# EAGLE design LEDStick_v02 (EAGLE 5.11)
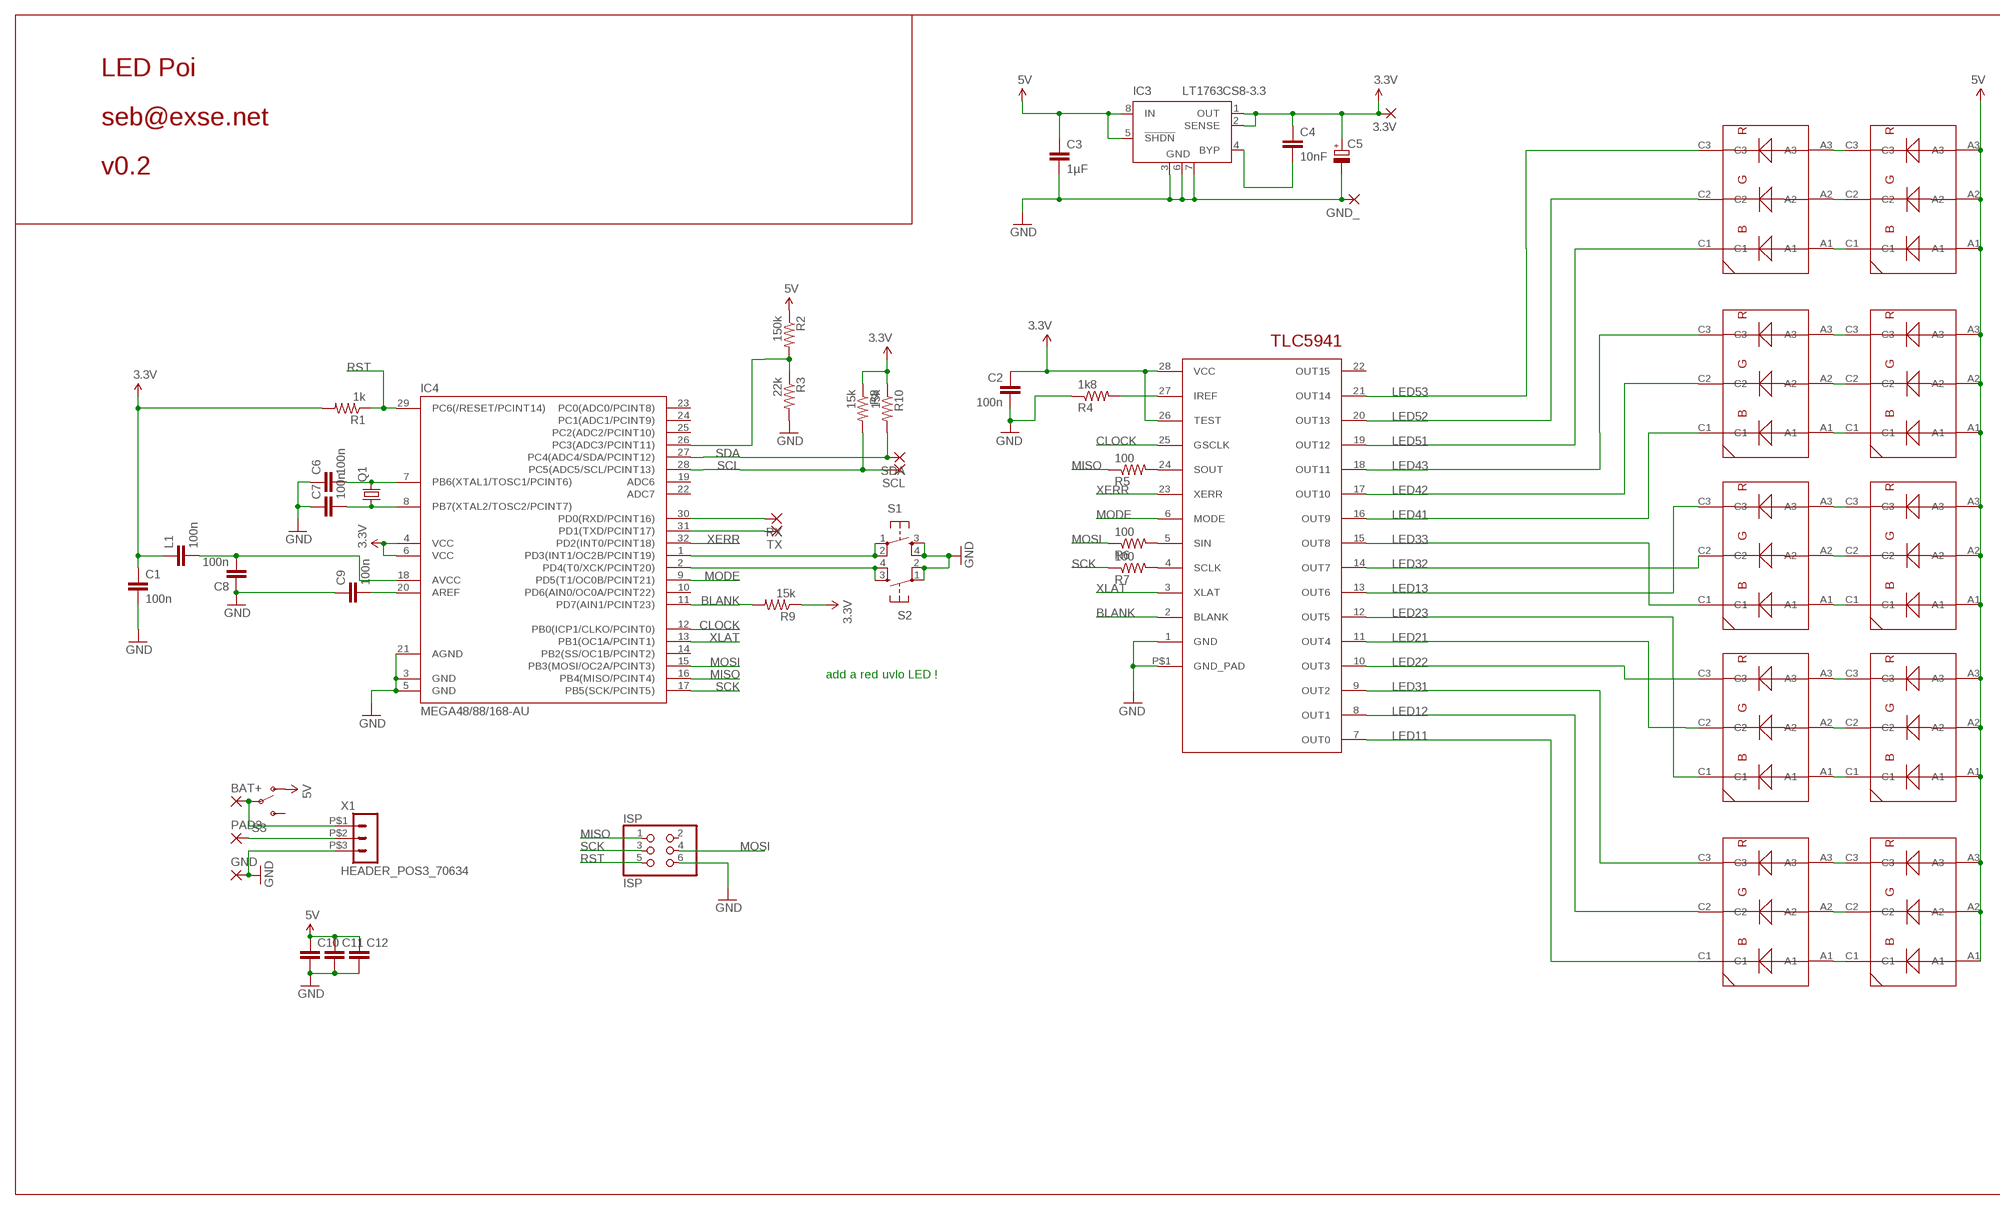
[diagram p0: schematic, sheet 1]

## Parts
3.3V  SMD2  [SMD1,27-2,54]
BAT+  SMD5  [SMD2,54-5,08]
C1  100n  CAP0805  [0805]
C2  100n  CAP0805  [0805]
C3  1µF  CAP0805  [0805]
C4  10nF  CAP0805  [0805]
C5  CPOL-EUSMCC  [SMC_C]
C6  100n  CAP0805  [0805]
C7  100n  CAP0805  [0805]
C8  100n  CAP0805  [0805]
C9  100n  CAP0805  [0805]
C10  C-EUC1210K  [C1210K]
C11  C-EUC1210K  [C1210K]
C12  C-EUC1210K  [C1210K]
D1  OSRAM_LRTB_GFTGSMALL  [PLCC-6_SMALL]
D2  OSRAM_LRTB_GFTGSMALL  [PLCC-6_SMALL]
D3  OSRAM_LRTB_GFTGSMALL  [PLCC-6_SMALL]
D4  OSRAM_LRTB_GFTGSMALL  [PLCC-6_SMALL]
D5  OSRAM_LRTB_GFTGSMALL  [PLCC-6_SMALL]
D6  OSRAM_LRTB_GFTGSMALL  [PLCC-6_SMALL]
D7  OSRAM_LRTB_GFTGSMALL  [PLCC-6_SMALL]
D8  OSRAM_LRTB_GFTGSMALL  [PLCC-6_SMALL]
D9  OSRAM_LRTB_GFTGSMALL  [PLCC-6_SMALL]
D10  OSRAM_LRTB_GFTGSMALL  [PLCC-6_SMALL]
GND  SMD5  [SMD2,54-5,08]
GND_  SMD2  [SMD1,27-2,54]
IC2  TLC5941  [SSOP28]
IC3  LT1763CS8-3.3  [SOIC8]
IC4  MEGA48/88/168-AU  [TQFP32-08]
ISP  ISP  PINHD-2X03_2.54  [2X03]
L1  100n  CAP0805  [0805]
PAD3  SMD5  [SMD2,54-5,08]
Q1  X22-OSCILLATOR  [X22]
R1  1k  RESISTOR  [0805]
R2  150k  RESISTOR  [0805]
R3  22k  RESISTOR  [0805]
R4  1k8  RESISTOR  [0805]
R5  100  RESISTOR  [0805]
R6  100  RESISTOR  [0805]
R7  100  RESISTOR  [0805]
R8  15k  RESISTOR  [0805]
R9  15k  RESISTOR  [0805]
R10  15k  RESISTOR  [0805]
RX  SMD2  [SMD1,27-2,54]
S1  LSH  [LSH]
S2  LSH  [LSH]
S3  SWITCH-SPSTPTH_LOCK  [SWITCH-SPDT_LOCK.007S]
SCL  SMD2  [SMD1,27-2,54]
SDA  SMD2  [SMD1,27-2,54]
TX  SMD2  [SMD1,27-2,54]
X1  HEADER_POS3_70634  [70634-POS3]

## Nets
3.3V: 3.3V.1(P) C1.1 C2.1 C4.1 C5.+ IC2.26(TEST) IC2.28(VCC) IC3.1(OUT) IC3.2(SENSE) IC4.4(VCC) IC4.6(VCC) L1.1 R1.2 R8.1 R9.1 R10.1
5V: C3.1 C10.1 C11.1 C12.1 D1.A1 D1.A2 D1.A3 D3.A1 D3.A2 D3.A3 D5.A1 D5.A2 D5.A3 D7.A1 D7.A2 D7.A3 D9.A1 D9.A2 D9.A3 IC3.5(!SHDN) IC3.8(IN) R2.1 S3.1(O)
BLANK: IC2.2(BLANK) IC4.11(PD7(AIN1/PCINT23)) R9.2
CLOCK: IC2.25(GSCLK) IC4.12(PB0(ICP1/CLKO/PCINT0))
GND: C1.2 C2.2 C3.2 C5.- C6.1 C7.1 C8.1 C9.1 C10.2 C11.2 C12.2 GND.1(P) GND_.1(P) IC2.1(GND) IC2.P$1(GND_PAD) IC3.3(GND) IC3.6(GND) IC3.7(GND) IC4.3(GND) IC4.5(GND) IC4.21(AGND) ISP.6 R3.2 R4.1 S1.3 S1.4 S2.1 S2.2 X1.P$3
LED11: D10.C1 IC2.7(OUT0)
LED12: D10.C2 IC2.8(OUT1)
LED13: D6.C3 IC2.13(OUT6)
LED21: D8.C2 IC2.11(OUT4)
LED22: D8.C3 IC2.10(OUT3)
LED23: D8.C1 IC2.12(OUT5)
LED31: D10.C3 IC2.9(OUT2)
LED32: D6.C2 IC2.14(OUT7)
LED33: D6.C1 IC2.15(OUT8)
LED41: D4.C1 IC2.16(OUT9)
LED42: D4.C2 IC2.17(OUT10)
LED43: D4.C3 IC2.18(OUT11)
LED51: D2.C1 IC2.19(OUT12)
LED52: D2.C2 IC2.20(OUT13)
LED53: D2.C3 IC2.21(OUT14)
MISO: IC4.16(PB4(MISO/PCINT4)) ISP.1 R5.1
MODE: IC2.6(MODE) IC4.9(PD5(T1/OC0B/PCINT21))
MOSI: IC4.15(PB3(MOSI/OC2A/PCINT3)) ISP.4 R6.1
N$1: IC2.24(SOUT) R5.2
N$2: C4.2 IC3.4(BYP)
N$3: C6.2 IC4.7(PB6(XTAL1/TOSC1/PCINT6)) Q1.3
N$4: IC2.5(SIN) R6.2
N$5: IC2.4(SCLK) R7.2
N$6: C7.2 IC4.8(PB7(XTAL2/TOSC2/PCINT7)) Q1.1
N$7: D1.C3 D2.A3
N$8: D1.C2 D2.A2
N$9: D1.C1 D2.A1
N$10: D3.C3 D4.A3
N$11: D3.C2 D4.A2
N$12: D3.C1 D4.A1
N$13: IC2.27(IREF) R4.2
N$14: D5.C3 D6.A3
N$15: D5.C2 D6.A2
N$16: D5.C1 D6.A1
N$17: D7.C3 D8.A3
N$18: D7.C2 D8.A2
N$19: D7.C1 D8.A1
N$20: D9.C3 D10.A3
N$21: D9.C2 D10.A2
N$22: D9.C1 D10.A1
N$23: IC4.1(PD3(INT1/OC2B/PCINT19)) S1.1 S1.2
N$24: IC4.2(PD4(T0/XCK/PCINT20)) S2.3 S2.4
N$25: IC4.26(PC3(ADC3/PCINT11)) R2.2 R3.1
N$26: BAT+.1(P) S3.2(P) X1.P$1
N$27: C8.2 IC4.18(AVCC) L1.2
N$28: C9.2 IC4.20(AREF)
N$29: PAD3.1(P) X1.P$2
N$31: IC4.30(PD0(RXD/PCINT16)) RX.1(P)
N$32: IC4.31(PD1(TXD/PCINT17)) TX.1(P)
RST: IC4.29(PC6(/RESET/PCINT14)) ISP.5 R1.1
SCK: IC4.17(PB5(SCK/PCINT5)) ISP.3 R7.1
SCL: IC4.28(PC5(ADC5/SCL/PCINT13)) R8.2 SCL.1(P)
SDA: IC4.27(PC4(ADC4/SDA/PCINT12)) R10.2 SDA.1(P)
XERR: IC2.23(XERR) IC4.32(PD2(INT0/PCINT18))
XLAT: IC2.3(XLAT) IC4.13(PB1(OC1A/PCINT1))
Unconnected: IC2.22(OUT15) IC4.10(PD6(AIN0/OC0A/PCINT22)) IC4.14(PB2(SS/OC1B/PCINT2)) IC4.19(ADC6) IC4.22(ADC7) IC4.23(PC0(ADC0/PCINT8)) IC4.24(PC1(ADC1/PCINT9)) IC4.25(PC2(ADC2/PCINT10)) ISP.2 S3.3(S)

## Notes on the sheet
- LED Poi
- seb@exse.net
- v0.2
- add a red uvlo LED !

## Library data of the parts
3.3V GND_ RX SCL SDA TX = wirepad:SMD2: SMD PAD
BAT+ GND PAD3 = wirepad:SMD5: SMD PAD
C1-C4 C6-C9 L1 = SparkFun:CAP: Capacitor Standard 0603 ceramic capacitor, and 0.1" leaded capacitor.
C5 = resistor:CPOL-EU: POLARIZED CAPACITOR, European symbol
C10-C12 = rcl:C-EU: CAPACITOR, European symbol
D1-D10 = seb:OSRAM_LRTB_GFTG
IC2 = tlc:TLC5941
IC3 = linear-technology:LT1763CS8: 500mA, Low Noise, LDO Micropower Regulators Source: http://cds.linear.com/docs/Datasheet/1763ff.pdf
IC4 = avr-7:MEGA48/88/168
ISP = pinhead-2:PINHD-2X03: PIN HEADER
Q1 = seb:X22-OSCILLATOR
R1-R10 = SparkFun:RESISTOR: Resistor Basic schematic elements and footprints for 0603, 1206, and PTH 1/10th watt (small) resistors.
S1 S2 = switch-tact:LSH
S3 = SparkFun:SWITCH-SPST: SPST Switch Simple slide switch. Spark Fun Electronics SKU : COM-00102
X1 = con-molex-c-grid-sl:HEADER_POS3_?: Molex -C-Grid® / SL Series connector Wire-to-Board 2.54 mm (0.100") pitch header, 3 positions.

## Board
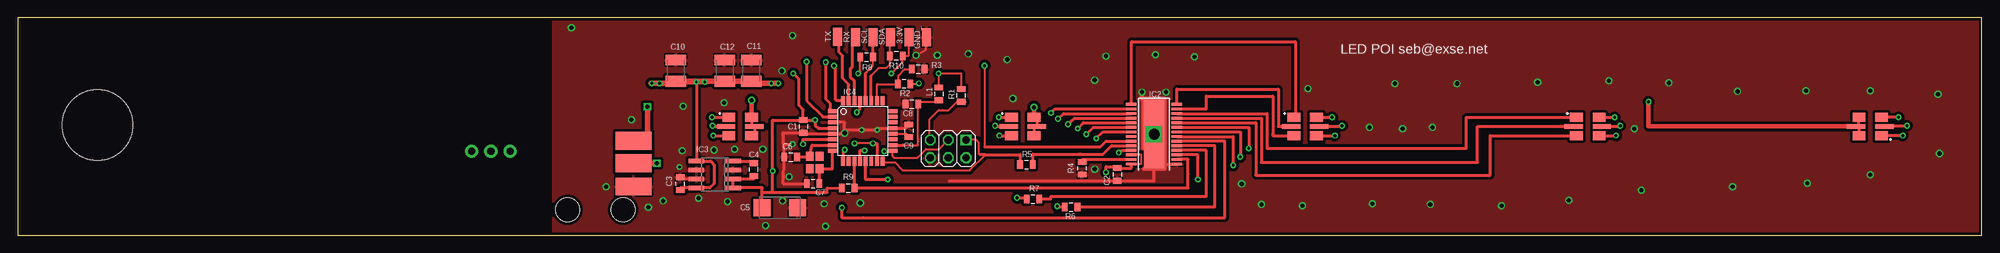
[diagram p1: board, top side]
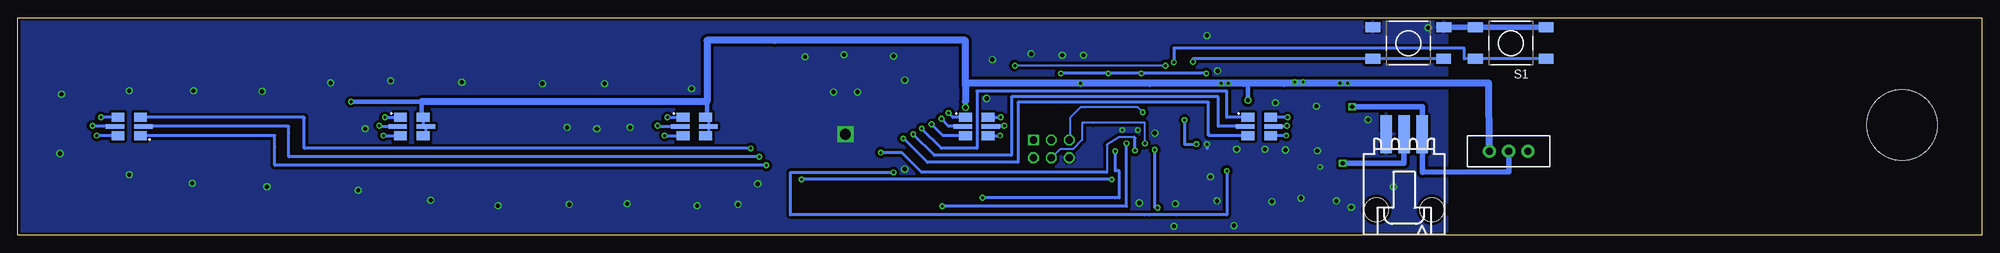
[diagram p2: board, bottom side, seen from below]

Size 278.1 x 30.8 mm. Coordinates in mm from the lower left corner, seen from the top.
Outline: 278.1,30.8 0,30.8 0,0 278.1,0 278.1,30.8
Copper layers (1*16): Top 0.035mm / dielectric 1.5mm / Bottom 0.035mm
Design rules "default *": minimum track width 10mil, minimum drill 0.4mm, track to track 8mil, track to pad 8mil, pad to pad 8mil, via to via 8mil, smd to smd 8mil, copper to edge 8mil, drill to drill 8mil, minimum pad ring 10mil, minimum via ring 8mil, stop-mask expansion 4mil, vias tented up to drill 100mil, thermal gap 10mil
Holes 10 mm at 11.3,15.6

### Footprints (pad centres in the part's own frame; a part is rotated, then mirrored left to right if it is on the bottom)
SMD1,27-2,54 = smd 1.27 x 2.54: 1 0,0
SMD2,54-5,08 = smd 2.54 x 5.08: 1 0,0
0805 = smd 0.8 x 1.2: 1 -0.9,0; 2 0.9,0
SMC_C = smd 2.4 x 2.4: + -2.5,0; - 2.5,0
C1210K = smd 1.5 x 2.9: 1 -1.5,0; 2 1.5,0
PLCC-6_SMALL = smd 1.3 x 1.8: A1 1.3,-1.6; A3 -1.3,-1.6; C1 1.3,1.6; C3 -1.3,1.6 | smd 0.6 x 2.6: A2 0,-2; C2 0,2
SSOP28 = smd 0.4 x 1.5: 1 -4.225,-3.225; 2 -3.575,-3.225; 3 -2.925,-3.225; 4 -2.275,-3.225; 5 -1.625,-3.225; 6 -0.975,-3.225; 7 -0.325,-3.225; 8 0.325,-3.225; 9 0.975,-3.225; 10 1.625,-3.225; 11 2.275,-3.225; 12 2.925,-3.225; 13 3.575,-3.225; 14 4.225,-3.225; 15 4.225,3.225; 16 3.575,3.225; 17 2.925,3.225; 18 2.275,3.225; 19 1.625,3.225; 20 0.975,3.225; 21 0.325,3.225; 22 -0.325,3.225; 23 -0.975,3.225; 24 -1.625,3.225; 25 -2.275,3.225; 26 -2.925,3.225; 27 -3.575,3.225; 28 -4.225,3.225 | smd 9.7 x 2.8: P$1 0,0
SOIC8 = smd 0.6 x 2.2: 1 -1.905,-2.6; 2 -0.635,-2.6; 3 0.635,-2.6; 4 1.905,-2.6; 5 1.905,2.6; 6 0.635,2.6; 7 -0.635,2.6; 8 -1.905,2.6
TQFP32-08 = smd 1.27 x 0.559: 1 -4.293,2.8; 2 -4.293,2; 3 -4.293,1.2; 4 -4.293,0.4; 5 -4.293,-0.4; 6 -4.293,-1.2; 7 -4.293,-2; 8 -4.293,-2.8; 17 4.293,-2.8; 18 4.293,-2; 19 4.293,-1.2; 20 4.293,-0.4; 21 4.293,0.4; 22 4.293,1.2; 23 4.293,2; 24 4.293,2.8 | smd 0.559 x 1.27: 9 -2.8,-4.293; 10 -2,-4.293; 11 -1.2,-4.293; 12 -0.4,-4.293; 13 0.4,-4.293; 14 1.2,-4.293; 15 2,-4.293; 16 2.8,-4.293; 25 2.8,4.293; 26 2,4.293; 27 1.2,4.293; 28 0.4,4.293; 29 -0.4,4.293; 30 -1.2,4.293; 31 -2,4.293; 32 -2.8,4.293
2X03 = drill 1.016 square: 1 -2.54,-1.27 | drill 1.016 octagon: 2 -2.54,1.27; 3 0,-1.27; 4 0,1.27; 5 2.54,-1.27; 6 2.54,1.27
X22 = smd 1.3 x 1.1: 1 0.9,0.7; 2 -0.9,0.7; 3 -0.9,-0.7; 4 0.9,-0.7
LSH = smd 2.1 x 1.4: 1 -5.005,2.24; 2 5.015,2.24; 3 -5.005,-2.24; 4 5.005,-2.24
SWITCH-SPDT_LOCK.007S = drill 1.016 pad 1.88 round: 1 0,2.718; 2 0,0; 3 0,-2.718
70634-POS3 = smd 1.651 x 5.334: P$1 -2.54,0; P$2 0,0; P$3 2.54,0 | hole 3.404: -3.937,10.693; 3.937,10.693

### Placement (x,y rotation side)
3.3V  126.2,28 0 top
BAT+  87.2,13.4 90 top
C1  111.23,15.41 270 top
C2  155.71,8.61 270 top
C3  93.8,7.3 90 top
C4  104.2,9.3 90 top
C5  107.9,3.9 0 top
C6  109.45,11.11 0 top
C7  112.61,7.3 0 top
C8  126.6,18.6 0 top
C9  126.2,14.8 270 top
C10  93.2,23.3 90 top
C11  103.9,23.3 90 top
C12  100.1,23.3 90 top
D1  102.3,15.4 90 top
D2  102.3,15.4 90 bottom
D3  142.3,15.4 90 top
D4  142.3,15.4 90 bottom
D5  182.3,15.4 90 bottom
D6  182.3,15.4 90 top
D7  222.3,15.4 90 bottom
D8  222.3,15.4 90 top
D9  262.3,15.4 270 top
D10  262.3,15.4 270 bottom
GND  87.2,6.9 90 top
GND_  128.7,28 0 top
IC2  160.9,14.3 90 top
IC3  98.7,8.6 90 top
IC4  119.66,14.77 0 top
ISP  131.75,12.22 180 top
L1  130.4,20 270 top
PAD3  87.2,10.2 90 top
Q1  112.85,10.3 270 top
R1  133.59,19.79 90 top
R2  125.5,21.4 180 top
R3  127.5,23.5 0 top
R4  150.7,9.49 90 top
R5  142.82,10 0 top
R6  149.15,4.03 0 top
R7  143.75,5.15 0 top
R8  120.2,25.2 0 top
R9  117.6,6.7 0 top
R10  124.4,25.4 180 top
RX  118.6,28 0 top
S1  66.7,27.2 180 bottom
S2  81.2,27.2 0 bottom
S3  67,11.9 90 bottom
SCL  121.1,28 0 top
SDA  123.6,28 0 top
TX  116.1,28.1 0 top
X1  81.8,14.3 180 bottom

### Tracks (layer width: path | path; a pad name or v marks a point on that pad's centre or on a via)
3.3V  (via drill 0.4)
  Top 0.305: IC2.26 159.1,11.38 159.1,10.1 157.68,10.1 IC2.28 | R1.2 133.59,22.9 v130.4,22.9 | 130.59,22.9 130.5,22.9 130.59,22.9 | v130.4,22.9 130.59,22.9 | v130.4,22.9 L1.1 | v130.4,22.9 130.59,22.9 | v123.7,22.9 125,24.2 125.3,24.5 R10.1 126.1,25.4 126.2,25.5 3.3V.1 | v119,22.9 119.3,23.2 R8.1
  Top 0.406: IC2.28 157.68,9.51 C2.1 155.71,9.7 154.1,9.7 v154.1,8.9 | C1.1 106.9,16.31 106.9,6.1 | 106.9,6.1 v106.9,9.1 | 106.9,6.1 v106.9,9.1 | v130.4,22.9 130.59,22.9 | 130.59,22.9 130.5,22.9 130.59,22.9 | 109.83,22.9 v109.8,22.9 110.6,22.1 110.6,18.4 111.23,17.77 C1.1 | R9.1 114.63,6.68 114.63,6.08 106.9,6.1 | 106.9,6.1 v106.9,9.1 | C4.1 104.2,7.96 IC3.2 IC3.1 105.4,6.7 105.4,6.1 | 105.4,6.1 C5.+ 105.4,6.1 | 105.4,6.1 106.9,6.1 | C1.1 111.8,16.31 | 111.8,16.31 v112.9,16.31 | v112.9,16.31 112.9,15.5 113.3,15.17 113.44,15.17 IC4.4 | v111.2,12.9 111.2,13.49 | 111.2,13.49 111.2,13.57 | 111.8,16.31 v112.9,16.31 | IC4.6 113.44,13.57 111.2,13.57 | 111.2,13.49 111.2,13.57
  Bottom 0.305: 118.6,22.9 v119,22.9 | v123.7,22.9 123.5,22.9
  Bottom 0.406: v154.1,8.9 168.7,8.9 168.7,6.5 168.7,2.9 117.9,2.9 | 117.9,2.9 114.1,2.9 106.9,2.9 v106.9,9.1 | 117.9,2.9 118.5,2.9 | v109.8,22.9 118.6,22.9 | 118.6,22.9 v119,22.9 | 118.6,22.9 v119,22.9 | 118.6,22.9 v119,22.9 | v119,22.9 v123.7,22.9 123.5,22.9 v130.4,22.9 | v111.2,12.9 112.9,12.9 v112.9,16.31
5V  (via drill 0.4, 0.6)  (1 unrouted)
  Top 0.305: R2.1 127.6,21.4 v127.6,21.5
  Top 0.406: 260.7,15.4 D9.A1 | 260.7,15.4 D9.A2 260.7,15.4 | 260.7,15.4 D9.A3 | D1.A3 104.3,14.1 D1.A2 | D1.A2 103.9,15.4 D1.A1 | D1.A2 104.5,15.4 | D3.A3 143.9,15.4 D3.A2 144.3,16.7 D3.A1 | C3.1 93.8,6.7 IC3.8 98,6.7 98.6,7.3 98.6,10 98.3,10.3 98.09,10.51 IC3.5 v96.1,21.7
  Top 0.61: D9.A2 230.9,15.4 v230.9,18.9 | v103.9,19.1 103.9,17.9 D1.A1 | v143.9,18.1 D3.A1 | v96.1,21.7 96.1,21.6
  Top 0.813: v106.7,21.5 103.9,21.5 C11.1 C12.1 C10.1 93.2,21.5 93.5,21.5 93.5,21.7 v96.1,21.7 v97.3,21.7 | v106.7,21.5 v107.7,21.5 v106.7,21.5 | v89.8,21.5 89.7,21.5 89.7,21.51 | v89.8,21.5 v90.9,21.5 | v90.9,21.5 93.5,21.5 | v89.8,21.5 v90.9,21.5
  Bottom 0.406: D5.A1 180.3,16.7 D5.A2 180.3,14.1 D5.A3 | D7.A3 220.3,14.1 D7.A2 220.7,15.4 D7.A1 | v96.1,21.7 100.5,21.7 98.8,21.5
  Bottom 0.61: v230.9,18.9 220.9,18.9 220.9,16.7 D7.A1 | 117.8,21.5 v127.6,21.5 | 180.3,16.7 180.5,16.7 180.5,18.9 | 143.9,18.9 v143.9,18.1 | 104.5,21.5 103.9,21.5 v103.9,19.1
  Bottom 1.016: 220.9,18.9 180.5,18.9 180.5,27.6 170.9,27.6 143.9,27.6 143.9,21.2 | 143.9,21.2 143.9,21.5 v127.6,21.5 117.8,21.5 104.5,21.5 98.8,21.5 69.8,21.52 S3.1 | 143.9,21.2 143.9,18.9
BLANK
  Top 0.406: IC2.2 165.7,10.72 165.7,8.7 165.7,6.7 137.5,6.7 R9.2 | R9.2 118.46,6.7 R9.2 | IC4.11 118.5,10.48 R9.2
CLOCK  (via drill 0.4)
  Top 0.406: IC2.25 156.3,12.03 v155.9,11.7 | v119.9,12 119.26,12 IC4.12
  Bottom 0.305: 123.9,8.9 123.9,12.8 122.2,13.9 120,13.9 119.9,13.8
  Bottom 0.406: v155.9,11.7 152.9,11.7 150.1,8.9 123.9,8.9 | v119.9,12 119.9,13.8 120,13.9
GND  (via drill 0.4, 0.6, 1.5)
  Top 0.305: 125.8,15.17 C9.1 | v127.2,25.46 128.6,26.27 GND_.1
  Top 0.406: IC2.1 160.9,10.07 IC2.P$1 160.9,7.71 C2.2 131.89,7.71 | C7.1 108.4,7.3 C6.1 108.4,14.51 | 108.4,14.51 C1.2 111.63,14.37 IC4.5 117.1,14.37 v117.1,14.46 | IC3.7 94.2,7.96 C3.2 | 108.4,14.51 108.4,12.9 v109.7,12.9 | IC4.3 117.1,15.97 v117.1,14.46 | v117.1,14.46 117.1,14.9 v119.5,14.9 v121.7,14.9 121.7,15.17 IC4.21 125.8,15.17
  Top 0.61: 159.5,9.4 162.4,9.4 162.4,19.3 159.4,19.3 | 159.4,19.3 159.4,12.3 | v159.2,20.27 159.2,19.3 159.4,19.3
  Bottom 0.406: v109.7,12.9 109.7,12.27
  Bottom 0.813: S2.2 S1.4 S1.3
  other vias: 93.7,9.66 101.5,12.16 105.9,1.36 100.5,4.76 109.2,8.27 100,18.77 114.2,4.46 166.6,25.27 161.1,25.57 154.1,25.36 140.9,19.36 162.6,20.27 152.5,9.37 182.7,20.77 195,21.46 203.8,21.46 215.2,21.66 225.3,21.86 233.8,21.57 243.5,20.36 253.2,20.46 262.3,20.46 271.9,19.96 272.1,11.56 262.3,8.56 253.4,7.37 242.8,6.87 229.9,6.37 219.6,4.96 210.1,4.17 200,4.37 191.8,4.46 181.9,4.17 176.1,4.37 191.4,15.27 196.1,15.06 200.3,15.27 228.9,15.06 134.6,25.66 130.2,25.46 109.7,28.27 108.2,23.27 105.5,12.16 108.3,4.87 119.3,4.57 114.4,1.26 173.3,7.26 152.5,21.96 140.1,24.86 83.3,6.87 94.2,18.27 89.3,3.96 91.4,4.87 98.6,12.06 96.4,5.26 94.1,11.96 160.9,14.3 78.4,29.36 86.9,16.36
  pour Bottom (isolate 0.406): 75.8,0.1 278.1,0 278.2,30.8 75.8,30.9
  pour Top (isolate 0.406): 75.8,0.1 278.2,0 278.2,30.8 75.8,30.9
LED11  (via drill 0.4)
  Top 0.406: IC2.7 172.1,13.97 v172.1,9.9
  Bottom 0.406: v172.1,9.9 241.7,9.9 241.7,12.5 241.7,14.1 D10.C1
LED12  (via drill 0.4)
  Top 0.406: IC2.8 173.1,14.62 v173.1,11.1
  Bottom 0.406: v173.1,11.1 239.7,11.1 239.7,14.5 239.7,15.4 D10.C2
LED13
  Top 0.406: IC2.13 168.3,17.88 168.3,19.7 177.7,19.7 177.7,14.3 177.7,14.1 D6.C3
LED21
  Top 0.406: IC2.11 176.1,16.57 176.1,10.3 204.9,10.3 206.7,10.3 206.7,15.4 D8.C2
LED22
  Top 0.406: IC2.10 175.3,15.93 175.3,8.5 208.5,8.5 208.5,14.1 D8.C3
LED23
  Top 0.406: IC2.12 176.9,17.23 176.9,12.3 205.1,12.3 205.1,12.5 205.1,16.7 D8.C1
LED31  (via drill 0.4)
  Top 0.406: IC2.9 174.3,15.28 v174.3,12.3
  Bottom 0.406: v174.3,12.3 237.5,12.3 237.5,16.5 237.5,16.7 D10.C3
LED32
  Top 0.406: IC2.14 164.12,20.7 178.5,20.7 178.5,15.4 D6.C2
LED33
  Top 0.406: IC2.15 157.7,18.52 157.7,27.4 180.9,27.4 180.9,16.7 D6.C1
LED41  (via drill 0.4)
  Top 0.406: v146.3,17.3 146.9,17.88 IC2.16
  Bottom 0.406: D4.C1 145.7,16.7 v146.3,17.3
LED42  (via drill 0.4)
  Top 0.406: v147.3,16.5 148.1,17.23 IC2.17
  Bottom 0.406: D4.C2 146.3,15.4 v147.3,16.5
LED43  (via drill 0.4)
  Top 0.406: v148.7,15.7 149.7,16.57 IC2.18
  Bottom 0.406: D4.C3 147.1,14.1 v148.7,15.7
LED51  (via drill 0.4)
  Top 0.406: IC2.19 150.9,15.93 v150.1,15.1
  Bottom 0.406: v150.1,15.1 147.3,12.3 142.3,12.3 142.3,20.4 106.9,20.4 106.9,16.9 106.9,16.7 D2.C1
LED52  (via drill 0.4)
  Top 0.406: IC2.20 152.3,15.28 v151.3,14.3
  Bottom 0.406: v151.3,14.3 148.3,11.3 137.4,11.3 137.4,19.6 108.1,19.6 108.1,16.1 108.1,15.4 D2.C2
LED53  (via drill 0.4)
  Top 0.406: IC2.21 153.7,14.62 v152.7,13.7
  Bottom 0.406: v152.7,13.7 149.3,10.3 136.5,10.3 136.5,18.8 109.5,18.8 109.5,14.5 109.5,14.1 D2.C3
MISO
  Top 0.305: ISP.1 135.7,13.49 136.1,13.1 136.1,11.5 136.2,11.4 | 122.46,10.3 124.2,10.3 125.3,9.2 134.8,9.2 137,11.4
  Top 0.406: 136.2,11.4 137,11.4 141.93,11.4 R5.1 | IC4.16 122.46,10.3
MODE  (via drill 0.4)
  Top 0.406: IC2.6 170.9,13.32 170.9,4.5 170.9,2.5 119.7,2.5 116.86,2.5 116.7,2.5 v116.7,3.9 | 116.86,12.1 v117.1,12.1 116.86,12.1 | 116.86,12.1 IC4.9
  Bottom 0.406: v116.7,3.9 117.1,3.9 v117.1,12.1
MOSI  (via drill 0.4)
  Top 0.305: v121.1,13 v118.5,13
  Top 0.406: R6.1 147.3,4.03 v147.2,4.1 | v121.1,13 121.66,13 IC4.15
  Bottom 0.305: v118.5,13 118.5,15.9 119.1,15.9 125.8,15.9 127.1,15.9 127.4,15.9 127.4,13.5 128.7,12.2 130.5,12.2 ISP.4
  Bottom 0.406: v147.2,4.1 121.1,4.1 v121.1,13
N$1
  Top 0.406: IC2.24 154.9,12.68 153.7,11.5 150.5,11.5 150.3,11.5 143.72,11.5 R5.2
N$2
  Top 0.406: IC3.4 104.2,10.51 C4.2
N$3
  Top 0.406: C6.2 111.8,11.1 Q1.3 112.5,12.77 IC4.7
N$4
  Top 0.406: IC2.5 169.5,12.68 169.5,5.7 169.5,4.03 R6.2
N$5
  Top 0.406: IC2.4 168.3,12.03 168.3,6.9 168.3,5.5 146.3,5.5 146.3,5.15 R7.2
N$6
  Top 0.406: 115.01,9.4 Q1.1 C7.2 | 115.01,9.4 115.37,9.4 | 115.37,9.4 IC4.8 | 115.01,9.4 115.37,9.4
N$7  (via drill 0.4)
  Top 0.406: v98.5,14.1 D2.A3
  Bottom 0.406: v98.5,14.1 D2.A3
N$8  (via drill 0.4)
  Top 0.406: D2.A2 98.5,15.4 v98.4,15.5
  Bottom 0.406: v98.4,15.5 98.4,15.4 D2.A2
N$9  (via drill 0.4)
  Top 0.406: v98.3,16.7 D2.A1
  Bottom 0.406: v98.3,16.7 D2.A1
N$10  (via drill 0.4)
  Top 0.406: v139,14.1 D4.A3
  Bottom 0.406: D4.A3 v139,14.1
N$11  (via drill 0.4)
  Top 0.406: v138.4,15.5 138.6,15.4 D4.A2
  Bottom 0.406: D4.A2 138.4,15.4 v138.4,15.5
N$12  (via drill 0.4)
  Top 0.406: v138.9,16.7 D4.A1
  Bottom 0.406: D4.A1 v138.9,16.7
N$13
  Top 0.406: IC2.27 150.7,10.72 R4.2
N$14  (via drill 0.4)
  Top 0.406: D6.A3 v186.5,14.1
  Bottom 0.406: v186.5,14.1 D6.A3
N$15  (via drill 0.4)
  Top 0.406: D6.A2 187.5,15.4 v187.5,15.5
  Bottom 0.406: v187.5,15.5 187.5,15.4 D6.A2
N$16  (via drill 0.4)
  Top 0.406: D6.A1 v186.1,16.7
  Bottom 0.406: v186.1,16.7 D6.A1
N$17  (via drill 0.4)
  Top 0.406: D8.A3 v226.3,14.1
  Bottom 0.406: v226.3,14.1 D8.A3
N$18  (via drill 0.4)
  Top 0.406: v226.9,15.5 226.8,15.4 D8.A2
  Bottom 0.406: D8.A2 226.9,15.4 v226.9,15.5
N$19  (via drill 0.4)
  Top 0.406: D8.A1 v226.1,16.7
  Bottom 0.406: v226.1,16.7 D8.A1
N$20  (via drill 0.4)
  Top 0.406: v266.3,16.7 D10.A3
  Bottom 0.406: D10.A3 v266.3,16.7
N$21  (via drill 0.4)
  Top 0.406: D10.A2 267.5,15.4 v267.5,15.5
  Bottom 0.406: v267.5,15.5 267.5,15.4 D10.A2
N$22  (via drill 0.4)
  Top 0.406: v266.9,14.1 D10.A1
  Bottom 0.406: D10.A1 v266.9,14.1
N$23  (via drill 0.4)
  Top 0.406: v114.4,24.5 114.4,19.3 115,18.7 115,17.94 115,17.57 IC4.1
  Bottom 0.406: S1.1 S1.2 73.3,24.96 73.3,26.5 114.4,26.5 v114.4,24.5 114.34,24.56
N$24  (via drill 0.4)
  Top 0.406: 111.7,23.6 111.7,19.07 114,16.77 IC4.2 | 111.7,23.6 v111.7,24.56 111.7,23.6
  Bottom 0.406: S2.4 S2.3 111.7,24.96 v111.7,24.56
N$25
  Top 0.305: 121.7,19.06 121.7,19.1 121.7,21.4 R2.2 124.7,21.4 124.7,22.6 125.6,23.5 R3.1
  Top 0.406: IC4.26 121.7,19.1
N$26  (via drill 0.6)
  Top 0.813: BAT+.1 89.16,13.4 v89.16,18.2
  Bottom 0.813: X1.P$1 79.56,14.3 79.2,14.3 | 79.2,18.2 v89.16,18.2 | 79.2,14.3 79.2,18.2 | S3.2 67,9 79.2,8.9 79.2,13.4 79.2,14.3 | 79.2,14.3 79.2,18.2
  Bottom 1.016: 79.56,14.3 X1.P$1
N$27
  Top 0.305: 125.33,12.77 127.47,12.77 127.5,13.3 127.5,13.6 C8.2 127.5,18.9 130.4,18.9 L1.2
  Top 0.406: IC4.18 125.33,12.77
N$28
  Top 0.305: 123.98,14.4 125.8,14.4 C9.2
  Top 0.406: 123.98,14.4 IC4.20
N$29  (via drill 0.6)
  Top 0.813: v90.5,10.2 PAD3.1
  Bottom 0.813: v90.5,10.2 81.8,10.2 X1.P$2
N$31
  Top 0.406: RX.1 118.2,27.6 118.2,25.9 118.2,23.9 117.9,23.6 117.9,22.4 118.46,21.84 IC4.30
N$32
  Top 0.406: TX.1 116.3,27.9 116.3,25.9 116.8,25.4 116.8,22.2 117.66,21.34 IC4.31
RST  (via drill 0.4)
  Top 0.305: v118.8,17.4 119.26,17.86 | 134.21,18.89 R1.1 132.99,18.89 131.8,17.7 131.01,17.7 130.4,17.7 129.1,16.4 129.1,13.61 ISP.5
  Top 0.406: 119.26,17.86 IC4.29
  Bottom 0.305: v118.8,17.4 119.5,18.1 127,18.1 127.6,18.1 129.1,16.6 129.1,13.61 ISP.5
SCK  (via drill 0.4)
  Top 0.305: 123.9,11.92 123.9,11.2 124.1,11 127.4,11 128.6,12.2 130.45,12.2 ISP.3
  Top 0.406: R7.1 142.75,5.3 v141.5,5.3 | v122.7,11.9 123.95,11.9 IC4.17 123.9,11.92
  Bottom 0.406: v141.5,5.3 122.7,5.3 122.1,5.3 122.1,9.1 122.7,9.1 v122.7,11.9
SCL
  Top 0.305: 120.06,22.96 120.9,23.8 121.1,24 R8.2
  Top 0.406: R8.2 SCL.1 | IC4.28 120.06,22.96
SDA
  Top 0.305: SDA.1 123.5,27.9 R10.2 123.5,24.2 123,23.7 121.96,23.7 120.86,22.6
  Top 0.406: IC4.27 120.86,22.6
XERR  (via drill 0.4)
  Top 0.305: v136.9,24 136.9,12.5
  Top 0.406: IC2.23 154.1,13.32 153.3,12.5 136.9,12.5 | v115.6,24 115.8,23.8 115.8,19.2 115.94,19.06 IC4.32
  Bottom 0.305: v115.6,24 v136.9,24
XLAT  (via drill 0.4)
  Top 0.406: IC2.3 167.1,11.38 v167.1,7.9 | v123.2,7.9 120.06,7.9 IC4.13
  Bottom 0.406: v123.2,7.9 v167.1,7.9

### Text on the board
tNames: LED POI seb@exse.net
tStop: + | -